# Altium schematic sheet USB_port.SchDoc
size A; SheetNumber: 1; SheetTotal: 6
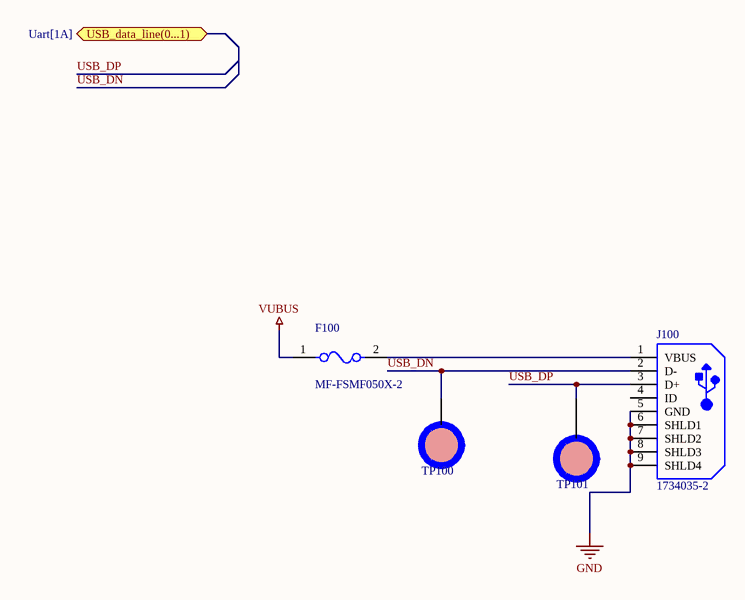
[diagram p0: USB_port.SchDoc]

## Parts
F100  MF-FSMF050X-2  [FP-MF-FSMF-MFG]
J100  1734035-2  [TECO-1734035-2-5_V]
TP100  TP  [TEST_POINT]  (value not drawn)  (no BOM)
TP101  TP  [TEST_POINT]  (value not drawn)  (no BOM)

## Ports
USB_data_line(0...1) (bidir, see Uart[1A])

## Nets
GND: J100.5(GND) J100.6(SHLD1) J100.7(SHLD2) J100.8(SHLD3) J100.9(SHLD4)
VUBUS: F100.1
USB_DN: J100.2(D-)
USB_DP: J100.3(D+)
NetF100_2: F100.2 J100.1(VBUS)

Not connected (* = marked no-connect by the designer): J100 4(ID); TP100 1; TP101 1

## Library data of the parts
F100 = CMP-07400-000010-1: PTC RESET FUSE 6V 500MA 0603; Manufacturer: Bourns Inc.; Trip Current: 1A; Current Rating: 40A; Hold Current: 0.5A; Resistance: 0.1-0.8Ω; Value: 0.1-0.8Ω; Description: Polymeric PTC Resettable Fuse 6V 500mA Ih Surface Mount 0603 (1608 Metric), Concave; Trip Time: 0.1s; Mouser Description: Resettable Fuses - PPTC 6volts 40amps; Category: Fuse; Digikey Description: PTC RESET FUSE 6V 500MA 0603; Temperature: -40°C to +85°C; Device Class L3: unset; Automotive: No; RoHS: TRUE; Ambient Temperature Range High: +85°C; Device Class L2: PTC Resettable Fuses; Temperature Range High: +85°C; Voltage Rating: 6V; Package: MF-FSMF; Manufacturer Part Number: MF-FSMF050X-2; Ambient Temperature Range Low: -40°C; Lead Free: Yes; ComponentLink2Description: Datasheet; Octopart: https://octopart.com/mf-fsmf050x-2-bourns-10470804; ComponentLink2URL: https://www.bourns.com/docs/Product-Datasheets/mffsmf.pdf; Temperature Range Low: -40°C; Height: 1mm; Device Class L1: Circuit Protection
J100 = CMP-2000-05407-1: Surface Mount Type B Mini USB, 5 Positions, 0.8 mm Pitch, 0 to 50 degC, RoHS, Tape and Reel; Manufacturer: TE Connectivity; Number of Contacts: 5; Pitch: 0.8mm; Body Orientation: RightAngle; Number of Ports: 1; Gender: RCP; Manufacturer URL: http://www.te.com/; Color: Black; Packaging: TapeandReel; Datasheet Version: Rev. B1, 07/2010; Housing Material: Thermoplastic; Termination Method: Solder; Part No: 1734035-2; Contact Plating: GoldOverNickel; Dimension: 4.14mm; Maximum Current Rating: N/A; Contact Material: PhosphorBronze; Number of Terminals: 5; Type: USB; Mounting: SurfaceMount; Datasheet URL: https://datasheet.ciiva.com/11759/0900766b80ed62f8-11759638.pdf; Operating Temperature: N/A; RoHS: Yes; Maximum Voltage Rating: N/A
TP100 TP101 = TEST_POINT